# EAGLE design Irdroino_IRDA_SHIELD (EAGLE 6.5.0)
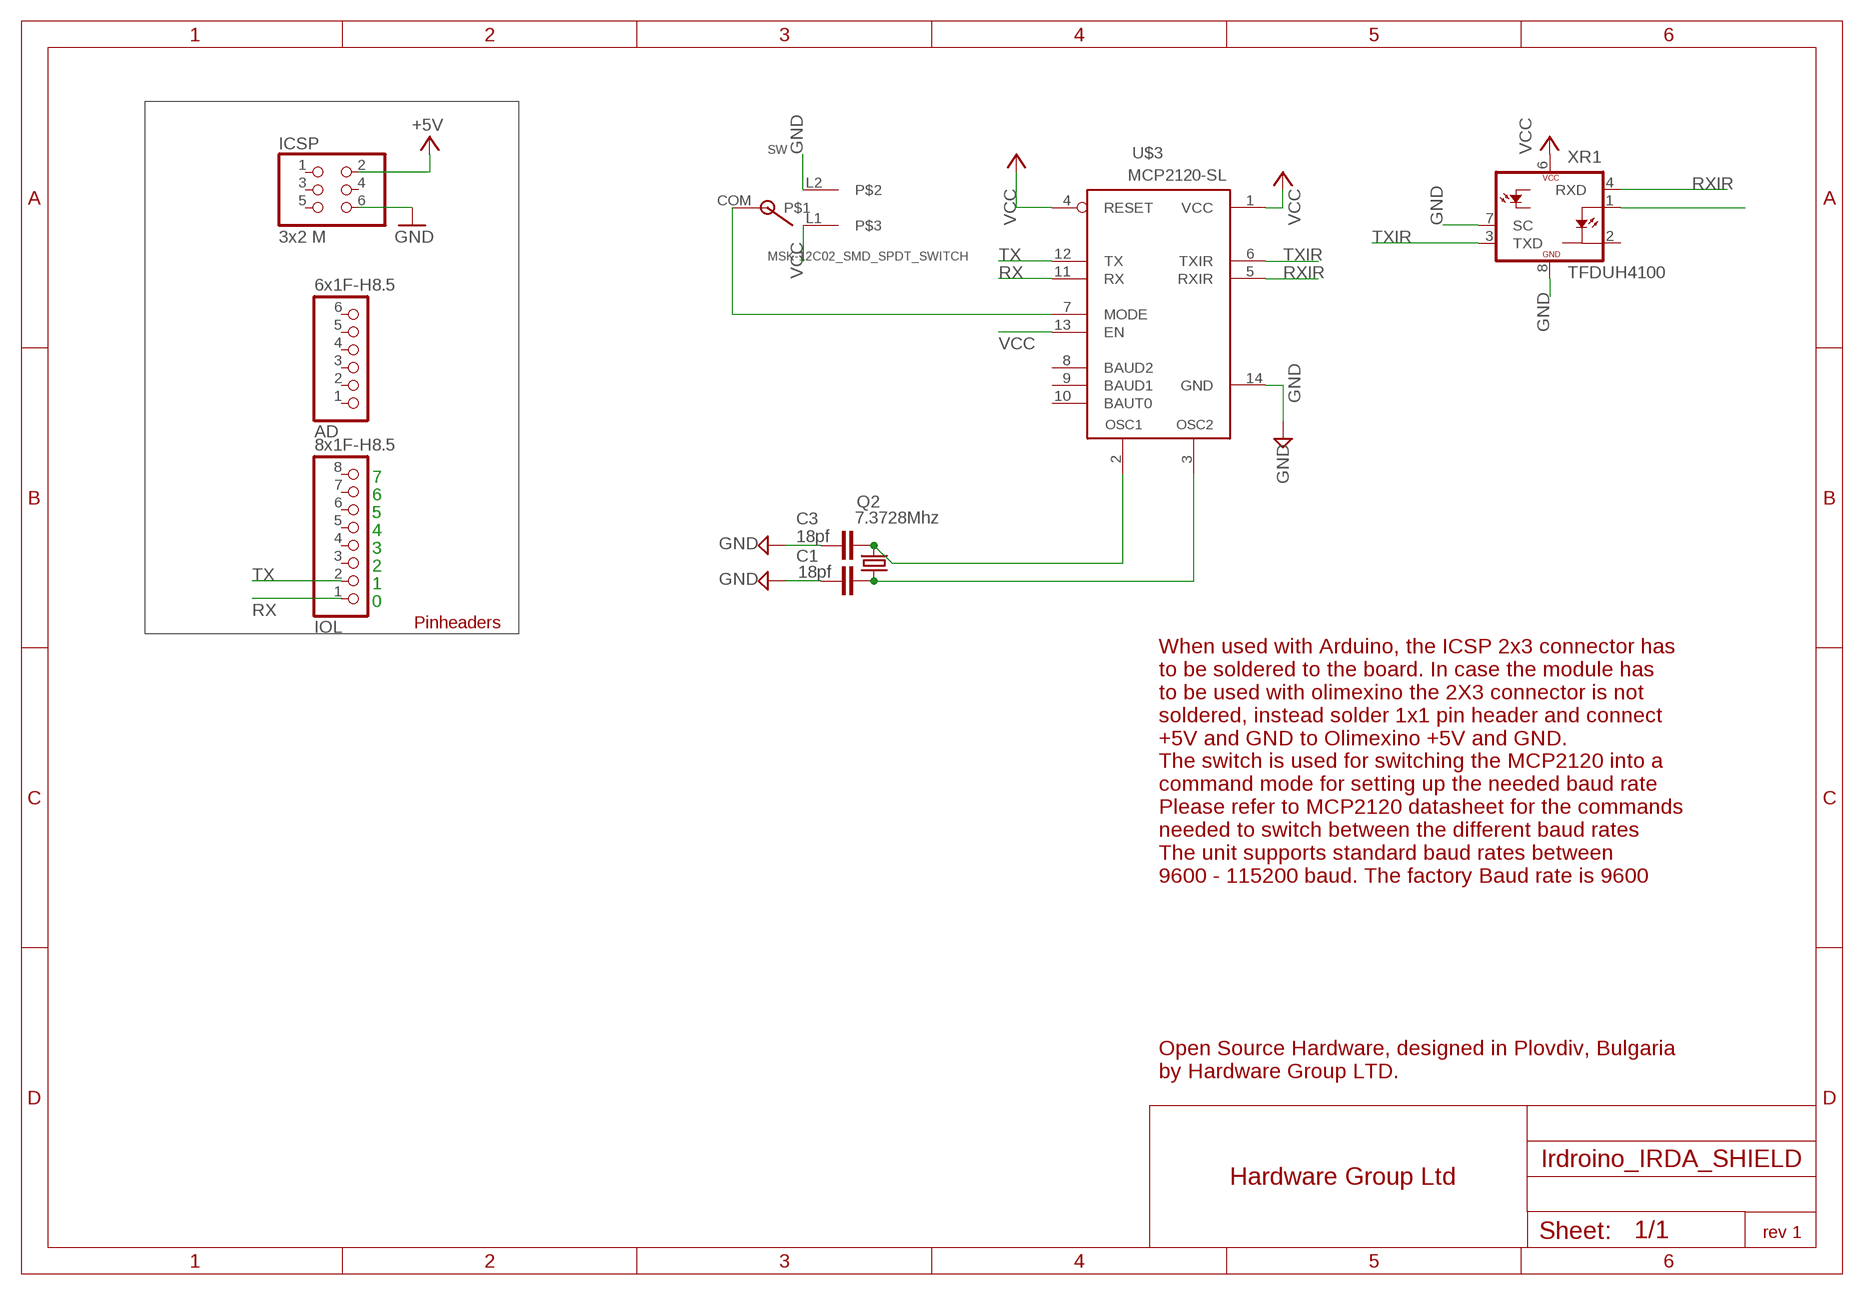
[diagram p0: schematic, sheet 1]

## Parts
AD  6x1F-H8.5  PINHD-1X6  [1X06]
C1  18pf  CAPC603  [C603]
C3  18pf  CAPC603  [C603]
ICSP  3x2 M  PINHD-2X3  [2X03]
IOL  8x1F-H8.5  PINHD-1X8  [1X08]
Q2  7.3728Mhz  CRYSTALHC49UP  [HC49UP]
SW  MSK-12C02_SMD_SPDT_SWITCH  [MSK-12C02]
U$3  MCP2120-SL  [SO-14]
XR1  TFDUH4100  [TFDU4-HOR]

## Nets
GND [gnd]: C1.2 C3.2 ICSP.6 SW.L2 U$3.14(GND) XR1.7(SC) XR1.8(GND)
N$4: C3.1 Q2.2 U$3.2(OSC1)
N$5: C1.1 Q2.1 U$3.3(OSC2)
N$10: SW.COM U$3.7(MODE)
RX: IOL.1 U$3.11(RX)
RXIR: U$3.5(RXIR) XR1.4(RXD)
TX: IOL.2 U$3.12(TX)
TXIR: U$3.6(TXIR) XR1.3(TXD)
VCC: ICSP.2 SW.L1 U$3.1(VCC) U$3.4(RESET) U$3.13(EN) XR1.1(IRED-A) XR1.6(VCC) ; supply symbol labelled +5V
Unconnected: AD.1 AD.2 AD.3 AD.4 AD.5 AD.6 ICSP.1 ICSP.3 ICSP.4 ICSP.5 IOL.3 IOL.4 IOL.5 IOL.6 IOL.7 IOL.8 U$3.8(BAUD2) U$3.9(BAUD1) U$3.10(BAUT0) XR1.2(IRED-C)

## Notes on the sheet
- 7
- 6
- 5
- 4
- 3
- 2
- 1
- 0
- Pinheaders
- When used with Arduino, the ICSP 2x3 connector has
  to be soldered to the board. In case the module has
  to be used with olimexino the 2X3 connector is not
  soldered, instead solder 1x1 pin header and connect
  +5V and GND to Olimexino +5V and GND.
  The switch is used for switching the MCP2120 into a 
  command mode for setting up the needed baud rate
  Please refer to MCP2120 datasheet for the commands
  needed to switch between the different baud rates
  The unit supports standard baud rates between 
  9600 - 115200 baud. The factory Baud rate is 9600
- Open Source Hardware, designed in Plovdiv, Bulgaria
  by Hardware Group LTD.
- Hardware Group Ltd
- rev 1

## Library data of the parts
AD = SmartPrj:PINHD-1X6: PIN HEADER
C1 C3 = dp_devices:CAP
ICSP = SmartPrj:PINHD-2X3: PIN HEADER
IOL = SmartPrj:PINHD-1X8: PIN HEADER
Q2 = crystal:CRYSTAL: CRYSTAL; OC_FARNELL: unknown; OC_NEWARK: unknown
SW = MSK-12C02 SMD Micro Slider Switch SPDT:MSK-12C02_SMD_SPDT_SWITCH: Footprint of the VIMEX MSK-12C02 SPDT SMD Switch Created by mzst on 17-Jan-2016
U$3 = microchip_mcp2120:MCP2120: Infrared Encoder/Decoder
XR1 = opto-vishay:TFD?4100: 2.7 V to 5.5 V Serial Infrared Transceiver Module Family (SIR, 115.2 kbit/s) Vishay Telefunken; MPN: TFDU4101-TT3; OC_FARNELL: 1652525; OC_NEWARK: 27M9702

## Net classes
1 power: width 0.61 mm, drill 0.61 mm, clearance 0.254 mm
2 gnd: width 0.305 mm, drill 0.559 mm, clearance 0.254 mm
3 usbvcc: width 0.305 mm, drill 0.61 mm, clearance 0.254 mm
4 aref: width 0.406 mm, drill 0.61 mm, clearance 0.254 mm

## Board
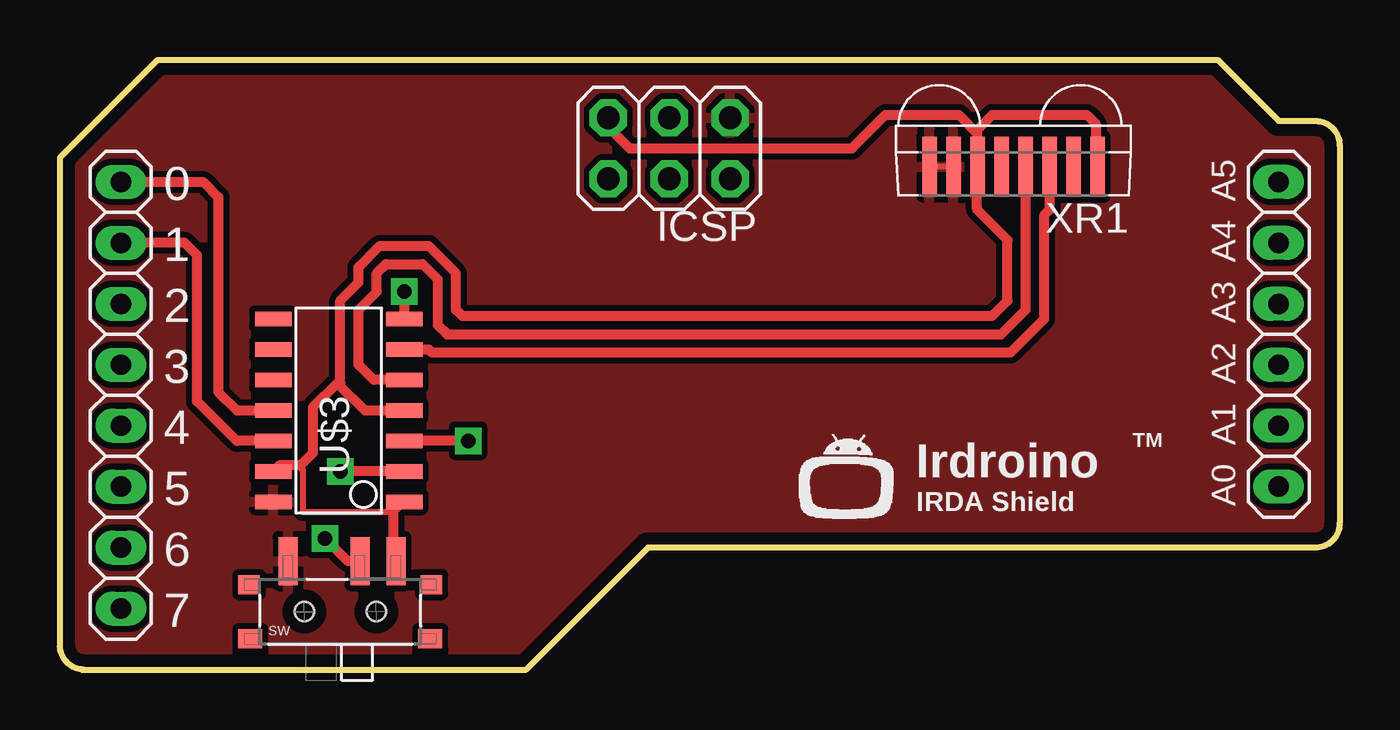
[diagram p1: board, top side]
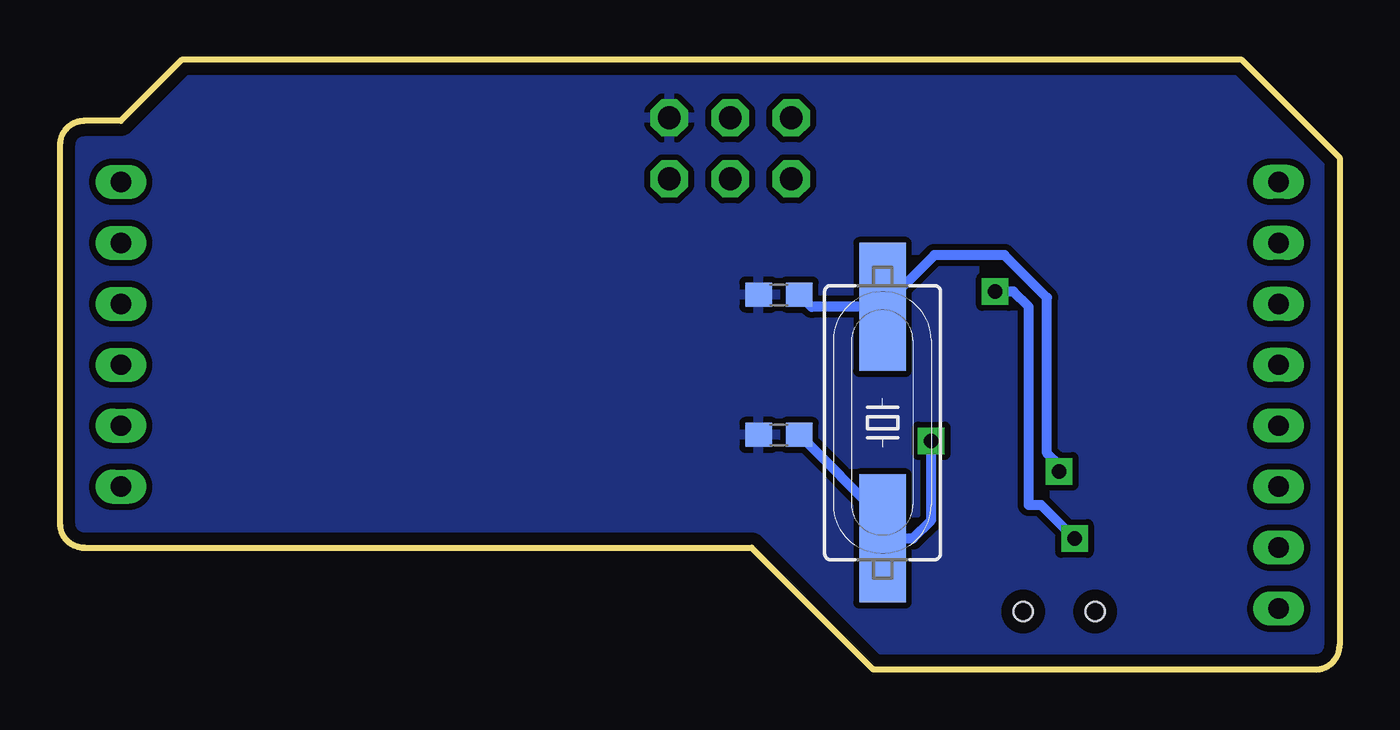
[diagram p2: board, bottom side, seen from below]

Size 53.34 x 25.4 mm. Coordinates in mm from the lower left corner, seen from the top.
Outline: 53.34,21.86 arc90 52.34,22.86 50.8,22.86 48.26,25.4 4.06,25.4 0,21.34 0,1.02
Outline: 53.34,6.08 arc-90 52.34,5.08
Outline: 1,0 arc-90 0,1
Outline: 0.89,0 19.43,0 24.51,5.08 52.32,5.08
Outline: 53.34,21.84 53.34,6.1
Copper layers (1*16): Top 0.035mm / dielectric 1.5mm / Bottom 0.035mm
Design rules "default *": minimum track width 10mil, minimum drill 22mil, track to track 10mil, track to pad 10mil, pad to pad 10mil, via to via 12mil, smd to smd 8mil, copper to edge 20mil, drill to drill 12mil, minimum pad ring 10mil, minimum via ring 10mil, stop-mask expansion 1mil, vias tented up to drill 30mil, thermal gap 10mil
vRestrict: area 17.5,18.8 to 19.3,23.9; area 20.1,20.2 to 21.7,23.9; area 23.1,20.1 to 24.3,23.5; area 25.7,20.1 to 26.8,23.5; area 28.2,20.1 to 29.3,23.5; area 30.7,20.1 to 31.9,23.5; area 33.4,22 to 34.5,23.5; area 34.9,19.8 to 42.3,21.6; area 55,18.9 to 56.4,21.5; area 57.5,18.9 to 58.9,21.5; area 56,10.5 to 59.4,11.9; area -4.7,-3.4 to -3.3,4.8; 14 more areas

### Footprints (pad centres in the part's own frame; a part is rotated, then mirrored left to right if it is on the bottom)
1X06 = drill 0.85 pad 1.422 long: 1 -6.35,0; 2 -3.81,0; 3 -1.27,0; 4 1.27,0; 5 3.81,0; 6 6.35,0
C603 = smd 1.1 x 1: 1 -0.85,0; 2 0.85,0
2X03 = drill 0.95 pad 1.55 octagon: 1 -2.54,-1.27; 2 -2.54,1.27; 3 0,-1.27; 4 0,1.27; 5 2.54,-1.27; 6 2.54,1.27
1X08 = drill 0.85 pad 1.422 long: 1 -8.89,0; 2 -6.35,0; 3 -3.81,0; 4 -1.27,0; 5 1.27,0; 6 3.81,0; 7 6.35,0; 8 8.89,0
HC49UP = smd 5.334 x 1.93: 1 -4.826,0; 2 4.826,0
MSK-12C02 = smd 0.8 x 2: COM 0.823,2.1; L1 2.323,2.1; L2 -2.177,2.1 | smd 1 x 0.8: GND@1 -3.75,-1.125; GND@4 3.75,-1.125 | smd 0.9 x 0.8: GND@2 -3.8,1.125; GND@3 3.8,1.125 | hole 0.8: -1.5,0; 1.5,0
SO-14 = smd 0.61 x 1.524: 1 -3.81,-2.794; 2 -2.54,-2.794; 3 -1.27,-2.794; 4 0,-2.794; 5 1.27,-2.794; 6 2.54,-2.794; 7 3.81,-2.794; 8 3.81,2.667; 9 2.54,2.667; 10 1.27,2.667; 11 0,2.667; 12 -1.27,2.667; 13 -2.54,2.667; 14 -3.81,2.667
TFDU4-HOR = smd 0.6 x 2.5: 1 -3.5,0; 2 -2.5,0; 3 -1.5,0; 4 -0.5,0; 5 0.5,0; 6 1.5,0; 7 2.5,0; 8 3.5,0

### Placement (x,y rotation side)
AD  50.8,13.97 90 top
C1  23.37,9.78 180 bottom
C3  23.37,15.62 180 bottom
ICSP  25.4,21.72 0 top
IOL  2.54,11.43 270 top
Q2  19.05,10.29 90 bottom
SW  11.68,2.41 0 top
U$2  [IRDROIDLOGO]  30.5,6.01 0 top
U$3  11.56,10.79 90 top
XR1  39.75,20.96 180 top

### Tracks (layer width: path | path; a pad name or v marks a point on that pad's centre or on a via)
GND
  Top 0.254: XR1.8 36.28,20.95 XR1.7
  pour Top: 48.26,25.4 50.8,22.86 52.58,22.86 53.34,22.1 53.34,5.71 52.58,4.95 24.38,4.95 19.43,0 0.64,0 0,0.64 0,21.34 4.06,25.4
  pour Bottom: 4.06,25.4 48.26,25.4 50.8,22.86 52.58,22.86 53.34,22.1 53.34,5.59 52.7,4.95 24.38,4.95 19.43,0 0.64,0 0,0.64 0,21.34
N$4  (via drill 0.6)
  Top 0.406: U$3.2 v11.68,8.25
  Bottom 0.406: C3.1 22.01,15.11 Q2.2 16.89,17.27 13.97,17.27 12.19,15.49 12.19,9.02 11.68,8.51 v11.68,8.25
N$5  (via drill 0.6)
  Top 0.406: v17.02,9.53 U$3.3
  Bottom 0.406: C1.1 19.05,6.31 Q2.1 17.78,5.46 17.02,6.22 v17.02,9.53
N$10  (via drill 0.6)
  Top 0.406: v14.35,15.75 U$3.7 | 12.38,4.26 SW.COM 12,4.51 v11.05,5.46
  Bottom 0.406: v14.35,15.75 13.59,15.75 12.95,15.11 12.95,6.86 12.45,6.86 v11.05,5.46
RX
  Top 0.406: IOL.1 5.97,20.32 6.6,19.68 6.6,11.56 7.37,10.79 U$3.11
RXIR
  Top 0.406: U$3.5 13.08,12.07 12.45,12.7 12.45,14.99 13.21,15.75 13.21,16.51 13.59,16.89 15.11,16.89 15.75,16.26 15.75,14.35 16.13,13.97 39.24,13.97 40.26,14.99 XR1.4
TX
  Top 0.406: U$3.12 7.37,9.53 5.71,11.18 5.71,17.27 5.21,17.78 IOL.2
TXIR
  Top 0.406: XR1.3 41.25,19.15 41.02,18.92 41.02,14.61 39.62,13.21 15.49,13.21 15.37,13.33 U$3.6
VCC
  Top 0.254: U$3.1 14.28,6.89 13.89,6.5 13.8,6.57 10.12,6.57 10.12,8.31 10.03,8.51 | 13.89,4.02 SW.L1
  Top 0.406: ICSP.2 22.86,22.61 23.75,21.72 33.02,21.72 34.42,23.11 37.47,23.11 38.23,22.35 38.23,20.98 XR1.6 | XR1.6 38.25,22.5 38.86,23.11 42.8,23.11 43.18,22.73 43.18,21.03 XR1.1 | 11.56,11.94 12.7,10.79 U$3.4 | 11.56,11.94 10.54,10.92 10.54,9.02 10.03,8.51 9.14,8.51 U$3.13 | XR1.6 38.23,20.93 38.23,19.18 39.5,17.91 39.5,15.37 38.86,14.73 16.76,14.73 16.51,14.99 16.51,16.51 15.37,17.65 13.34,17.65 12.45,16.76 12.45,16.13 11.68,15.37 11.68,11.94 11.56,11.94 | 13.89,6.5 13.89,4.63 SW.L1

### Text on the board
tPlace: 0 | 1 | 2 | 3 | 4 | 5 | 6 | 7
tNames: A5 | A4 | A3 | A2 | TM | A1 | Irdroino | IRDA Shield | A0
ReferenceLC: L | TX | ON | RX | PC1 | PC2
214bmp: D:/SmartProjects/Snc/a4_bn_logo2.bmp